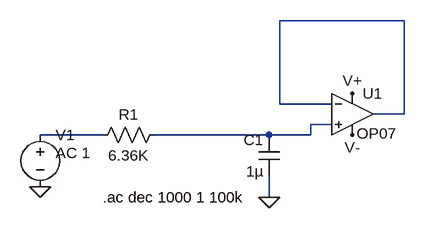
[diagram p0: schematic LPF.asc]
LPF.asc, the LTspice schematic file:
Version 4.1
SHEET 1 880 680
WIRE 304 0 112 0
WIRE 112 128 112 0
WIRE 192 128 112 128
WIRE 304 144 304 0
WIRE 304 144 256 144
WIRE 192 160 160 160
WIRE -160 176 -256 176
WIRE 96 176 -80 176
WIRE 160 176 160 160
WIRE 160 176 96 176
WIRE 96 272 96 240
FLAG 96 272 0
FLAG 224 112 V+
FLAG 224 176 V-
FLAG -256 256 0
SYMBOL res -64 160 R90
WINDOW 0 0 56 VBottom 2
WINDOW 3 32 56 VTop 2
SYMATTR InstName R1
SYMATTR Value 6.36K
SYMBOL cap 112 240 R180
WINDOW 0 24 56 Left 2
WINDOW 3 24 8 Left 2
SYMATTR InstName C1
SYMATTR Value 1µ
SYMBOL OpAmps\\OP07 224 80 R0
WINDOW 3 7 94 Left 2
SYMATTR InstName U1
SYMBOL voltage -256 160 R0
WINDOW 123 24 44 Left 2
WINDOW 39 0 0 Left 0
SYMATTR InstName V1
SYMATTR Value ""
SYMATTR Value2 AC 1
TEXT -160 272 Left 2 !.ac dec 1000 1 100k

The netlist it stands for:
* LPF.asc
R1 N002 N003 6.36K
C1 0 N002 1µ
X§U1 N002 N001 V+ V- N001 LT1001  ; OP07, pins In+ In- V+ V- OUT
V1 N003 0 AC 1
.ac dec 1000 1 100k
.lib LTC.lib
.backanno
.end